# Altium schematic sheet Power_Supply_TPS54260.SchDoc
size A4
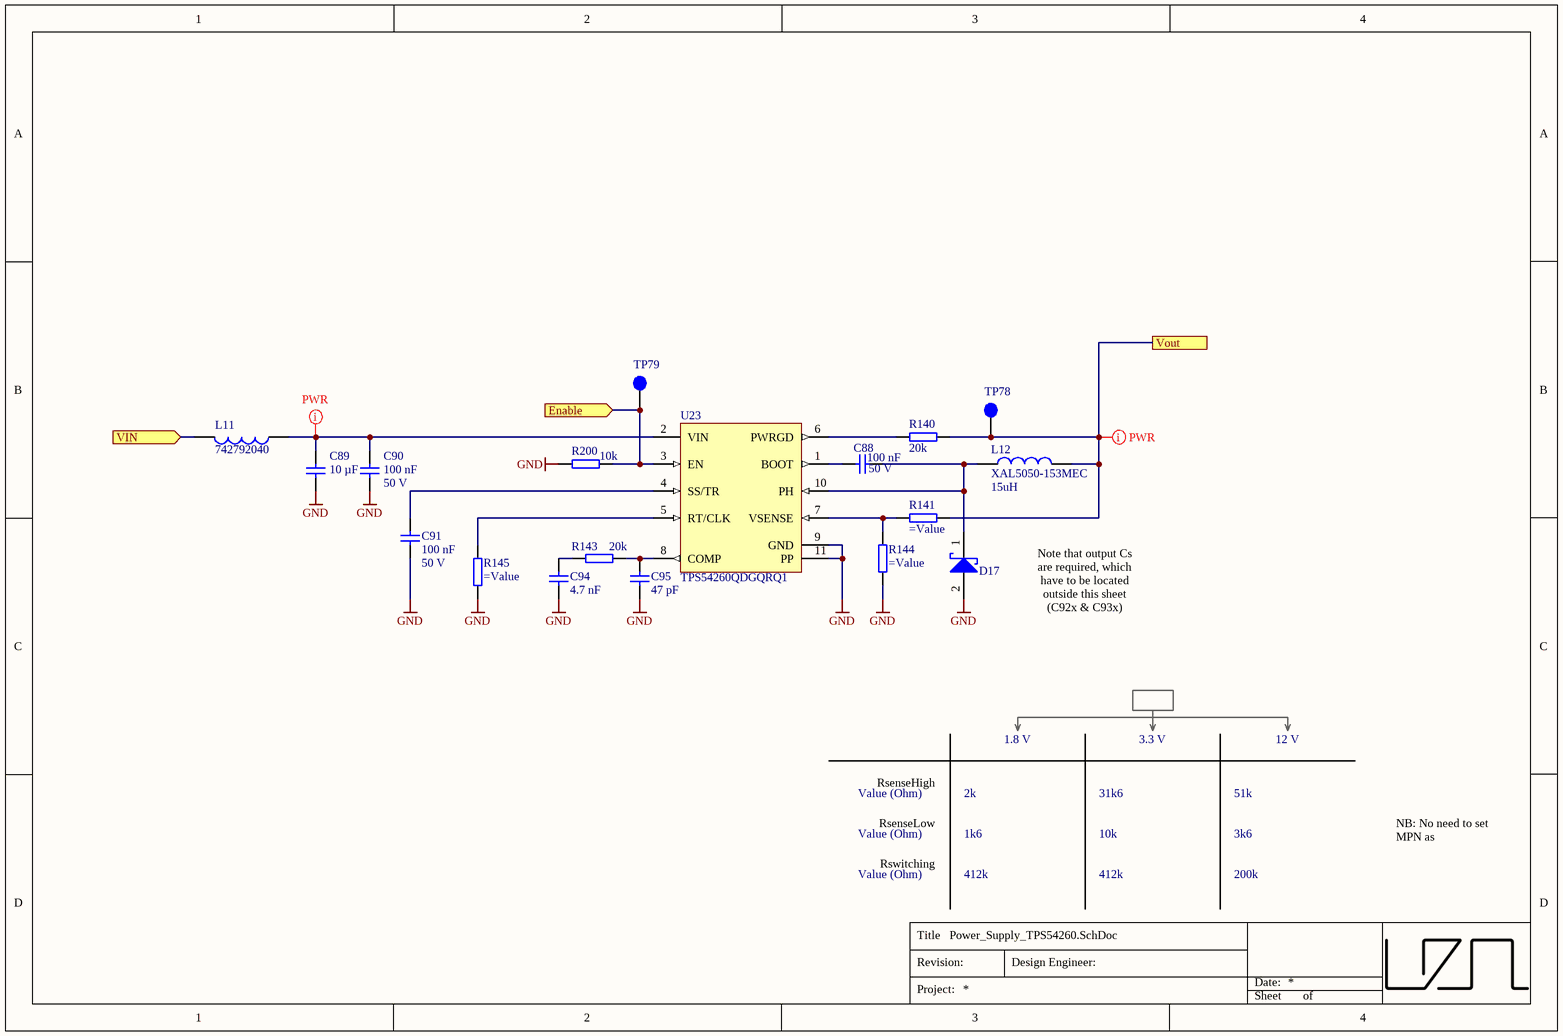
[diagram p0: Power_Supply_TPS54260.SchDoc]

## Parts
C88  100 nF  Voltage: 50 V  [C_0603_TE]
C89  10 µF  [C_1206_TE]
C90  100 nF  Voltage: 50 V  [C_0603_TE]
C91  100 nF  Voltage: 50 V  [C_0603_TE]
C94  4.7 nF  [C_0603_TE]
C95  47 pF  [C_0603_TE]
D17  STPS340UY  [SMB]  (value not drawn)
L11  742792040  [WE-CBF_0805_High Current]
L12  XAL5050-153MEC  value 15uH  [XAL5050153MEC]
R140  20k  [R_0603_TE]
R141  (no value)  [R_0603_TE]
R143  20k  [R_0603_TE]
R144  (no value)  [R_0603_TE]
R145  (no value)  [R_0603_TE]
R200  10k  [R_0603_TE]
TP78  Testpoint 1mm  [TP_1mm]  (value not drawn)  (no BOM)
TP79  Testpoint 1mm  [TP_1mm]  (value not drawn)  (no BOM)
U23  TPS54260QDGQRQ1  [TSOP-10_DGQ0010D_N]

## Ports
Enable (in), VIN (in), Vout

## Nets
GND: C89.2 C90.1 C91.1 C94.2 C95.2 D17.2(A) R144.2 R145.2 R200.1 U23.9(GND) U23.11(PP)
Enable: R200.2 TP79.1 U23.3(EN) ; port Enable
VIN: L11.2 ; port VIN
Vout: L12.2 R140.1 R141.1 TP78.1 ; port Vout
NetC88_1: C88.1 D17.1(K) L12.1 U23.10(PH)
NetC88_2: C88.2 U23.1(BOOT)
NetC89_1: C89.1 C90.2 L11.1 U23.2(VIN)
NetC91_2: C91.2 U23.4(SS/TR)
NetC94_1: C94.1 R143.2
NetC95_1: C95.1 R143.1 U23.8(COMP)
NetR140_2: R140.2 U23.6(PWRGD)
NetR141_2: R141.2 R144.1 U23.7(VSENSE)
NetR145_1: R145.1 U23.5(RT/CLK)

## Layout directives
net class PWR: NetC89_1, Vout

## Notes on the sheet
- Note that output Cs are required, which have to be located outside this sheet (C92x & C93x)
- RsenseHigh (@{"Id":"WRUMMABL\CGJYPHNX","ObjectType":2})
- 1.8 V
- 3.3 V
- 12 V
- RsenseLow (@{"Id":"WRUMMABL\LDWXELDL","ObjectType":2})
- Value (Ohm)
- 2k
- 1k6
- 31k6
- 10k
- 51k
- 3k6
- NB: No need to set MPN as parameter!
- Rswitching (@{"Id":"WRUMMABL\GZIHHFRB","ObjectType":2})
- 412k
- 200k
- Title
- Revision:
- Design Engineer:
- Date:
- Project:
- Sheet
- of

## Library data of the parts
C88 C90 C91 = UZgen_C_0603_100nF_50V_X7R: Generic capacitor; Manufacturer: UZgen; Tolerance: 10 %; Created from: AGeiger; Value: 100 nF; Technology: X7R; Manufacturer Part Number: UZgen_C_0603_100nF_50V_X7R; PartID: 1; Created On: 02/07/2024 14:42:23; Device Package: 0603; Mounting Type: SMD; Last Updated: 02/08/2024 14:45:57
C89 = UZgen_C_1206_10uF_50V_X7R: Generic capacitor; Manufacturer: UZgen; Tolerance: 10 %; Created from: MGeier; Voltage: 50V; Value: 10 µF; Manufacturer Part Number: UZgen_C_1206_10uF_50V_X7R; PartID: 5807; Created On: 20/03/2025 14:05:00; Device Package: 1206; Last Updated: 20/03/2025 14:05:00; Mounting Type: SMD; Technology: X7R
C94 = GRM1885C1H472JA01D: 50V 4.7nF C0G ±5% 0603 Multilayer Ceramic Capacitors MLCC; Manufacturer: Murata Electronics; Created from: MGeier; Tolerance: 5%; Value: 4.7 nF; Manufacturer Part Number: GRM1885C1H472JA01D; PartID: 153; Created On: 02/08/2024 16:00:00; ComponentLink1Description: Datasheet; ComponentLink1URL: https://wmsc.lcsc.com/wmsc/upload/file/pdf/v2/lcsc/2304140030_Murata-Electronics-GRM1885C1H472JA01D_C85980.pdf; Component Type: Capacitor 0603; Device Package: 0603; Last Updated: 02/08/2024 16:00:00; Mounting Type: SMD; Operating Temperature: –55 to 125°C; Series: GRM (Chip Multilayer Ceramic Capacitors for General Purpose); Supplier 1: LCSC; Supplier Part Number 1: C85980; Type: Capacitor; Voltage Rating: 50 V; Live Cycle Status: 1; LCSC Part Number: C85980; Stock number: not stored
C95 = CL10C470JB8NNNC: 50V 47pF C0G ±5% 0603 Multilayer Ceramic Capacitors MLCC; Manufacturer: Samsung Electro-Mechanics; Created from: MGeier; Tolerance: 5%; Value: 47 pF; Manufacturer Part Number: CL10C470JB8NNNC; PartID: 154; Created On: 02/08/2024 16:00:00; ComponentLink1Description: Datasheet; ComponentLink1URL: https://wmsc.lcsc.com/wmsc/upload/file/pdf/v2/lcsc/2304140030_Samsung-Electro-Mechanics-CL10C470JB8NNNC_C1671.pdf; Component Type: Capacitor 0603; Device Package: 0603; Last Updated: 02/08/2024 16:00:00; Mounting Type: SMD; Operating Temperature: –55 to 125°C; Series: CL; Supplier 1: LCSC; Supplier Part Number 1: C1671; Type: Capacitor; Voltage Rating: 50 V; Live Cycle Status: 1; LCSC Part Number: C1671; Stock number: not stored
D17 = STPS340UY: Power Schottky Rectifier, 3 A, 40 V, 0.57 µF; Manufacturer: STMicroelectronics; Forward Current: 3 A; Forward Voltage: 0.84 V; Reverse Current: 10 mA; Created from: MGremer; Manufacturer Part Number: STPS340UY; PartID: 1; Created On: 06/01/2021 14:34:10; ComponentLink1Description: Datasheet; ComponentLink1URL: https://www.mouser.de/datasheet/2/389/stps340_y-1851750.pdf; Component Type: Power Schottky Rectifier; Device Package: SMB; Last Updated: 04/09/2024 15:38:15; Mounting Type: SMD; Operating Temperature: -40 to +150 °C; Series: STPS340-Y; Supplier 1: Mouser; Supplier Part Number 1: 511-STPS340UY; Type: Power Schottky Rectifier; Value: -; Live Cycle Status: 1; Stock number: not stored; Supplier 2: LCSC; Supplier Part Number 2: C283520; LCSC Part Number: C283520
L11 = 742792040: Inductance, 0805, 100 MHz, 600 Ohm, 2 A; Manufacturer: Wuerth Elektronik; Type: Inductance SMD; DC current: 2 A; Value: 600 Ohm; Created from: AGeiger; Manufacturer Part Number: 742792040; PartID: 1; Created On: 18/01/2021 14:53:17; ComponentLink1Description: Datasheet; ComponentLink1URL: https://www.mouser.de/datasheet/2/445/742792040-1720361.pdf; Component Type: Inductance; Device Package: 0805; Last Updated: 22/08/2024 07:43:45; Mounting Type: SMD; Operating Temperature: -55 - 125 °C; Series: WE-CBF; Supplier 1: Mouser; Supplier Part Number 1: 710-742792040; Live Cycle Status: 1; LCSC Part Number: C2661857; Stock number: not stored
L12 = XAL5050-153MEC: 15uH@1MHz  ±20%, 3.9A, 76.7mOhm; Manufacturer: Coilcraft; MF: EPCOS / TDK; DCR: 320m; Rated Current: 0.85 A; Type: Inductance SMD; Created from: FRosner; MPN: B82464G4154M; Supplier 1: Mouser; Supplier Part Number 1: 994-XAL5050-153MEC; Manufacturer Part Number: XAL5050-153MEC; PartID: 24; Created On: 05/09/2024 12:44:32; ComponentLink1Description: Datasheet; ComponentLink1URL: https://www.mouser.de/datasheet/2/597/xal50xx-270657.pdf; Component Type: SMD Power Inductor; Device Package: 5.28 x5.1x5.48mm; Last Updated: 05/09/2024 12:44:32; Mounting Type: SMD; Operating Temperature: -40°C to +125°C; Series: XAL5050; Supplier 2: LCSC; Supplier Part Number 2: C5291298; DC current: 3.9 A; Live Cycle Status: 1; LCSC Part Number: C5291298; Stock number: not stored
R140 R143 = UZgen_R_0603_20k: Generic resistor; Manufacturer: UZgen; Tolerance: 1 %; Created from: UZgenTool; Value: 20k; Manufacturer Part Number: UZgen_R_0603_20k; PartID: 251; Created On: 02.07.2024 17:29:50; Device Package: 0603; Mounting Type: SMD; Last Updated: 02.07.2024 17:29:50
R141 R144 R145 = UZgen_R_0603_ParaR: Generic resistor (parametric); Manufacturer: UZgen; Tolerance: 1 %; Created from: UZgenTool; Manufacturer Part Number: ='UZgen_R_0603_'+"Value"; PartID: 588; Created On: 08/07/2024 14:34:30; Device Package: 0603; Mounting Type: SMD; Last Updated: 08/07/2024 14:34:30
  R141: Value: =RsenseHigh_Ohm
  R144: Value: =RsenseLow_Ohm
  R145: Value: =Rswitching_Ohm
R200 = UZgen_R_0603_10k: Generic resistor; Manufacturer: UZgen; Tolerance: 1 %; Created from: AGeiger; Value: 10k; Manufacturer Part Number: UZgen_R_0603_10k; PartID: 1; Created On: 02.07.2024 14:34:53; Device Package: 0603; Mounting Type: SMD; Last Updated: 02.07.2024 14:37:16
TP78 TP79 = NULL: Manufacturer Part Number: NULL; Created from: AGeiger; Created: 2018_06_25_AGeiger; Value: Testpoint 1mm; PartID: 9; Created On: 20/09/2022 13:14:57; Component Type: Testpoint; Last Updated: 20/09/2022 13:15:39; Manufacturer: NULL; Supplier 1: NULL; Supplier Part Number 1: NULL; Type: Testpoint; Live Cycle Status: 1
U23 = TPS54260QDGQRQ1: High Efficiency Step-Down Converter, MSOP Package, 2.5 A, 3.5 - 60 V input, adjustable output; Manufacturer: Texas Instruments; Created from: MGremer; Value: 2.5 A; Manufacturer Part Number: TPS54260QDGQRQ1; PartID: 4; Created On: 06/01/2021 09:48:37; ComponentLink1Description: Datasheet; ComponentLink1URL: https://www.ti.com/general/docs/suppproductinfo.tsp?distId=26&gotoUrl=http%3A%2F%2Fwww.ti.com%2Flit%2Fgpn%2Ftps54260-q1; Component Type: Step-Down Converter; Last Updated: 12/09/2024 22:45:16; Mounting Type: SMD; Supplier 1: Mouser; Supplier Part Number 1: 595-TPS54260QDGQRQ1; Type: Step-Down Converter; Live Cycle Status: 1; LCSC Part Number: C181278; Stock number: not stored; Device Package: MSOP; Series: TPS54260-Q1